# Altium schematic sheet ZHSD-ZYNQ-PL.SchDoc
size A3; DrawnBy: UGUR KELES; DocumentNumber: 14; SheetNumber: 14; SheetTotal: 17; Size: A3
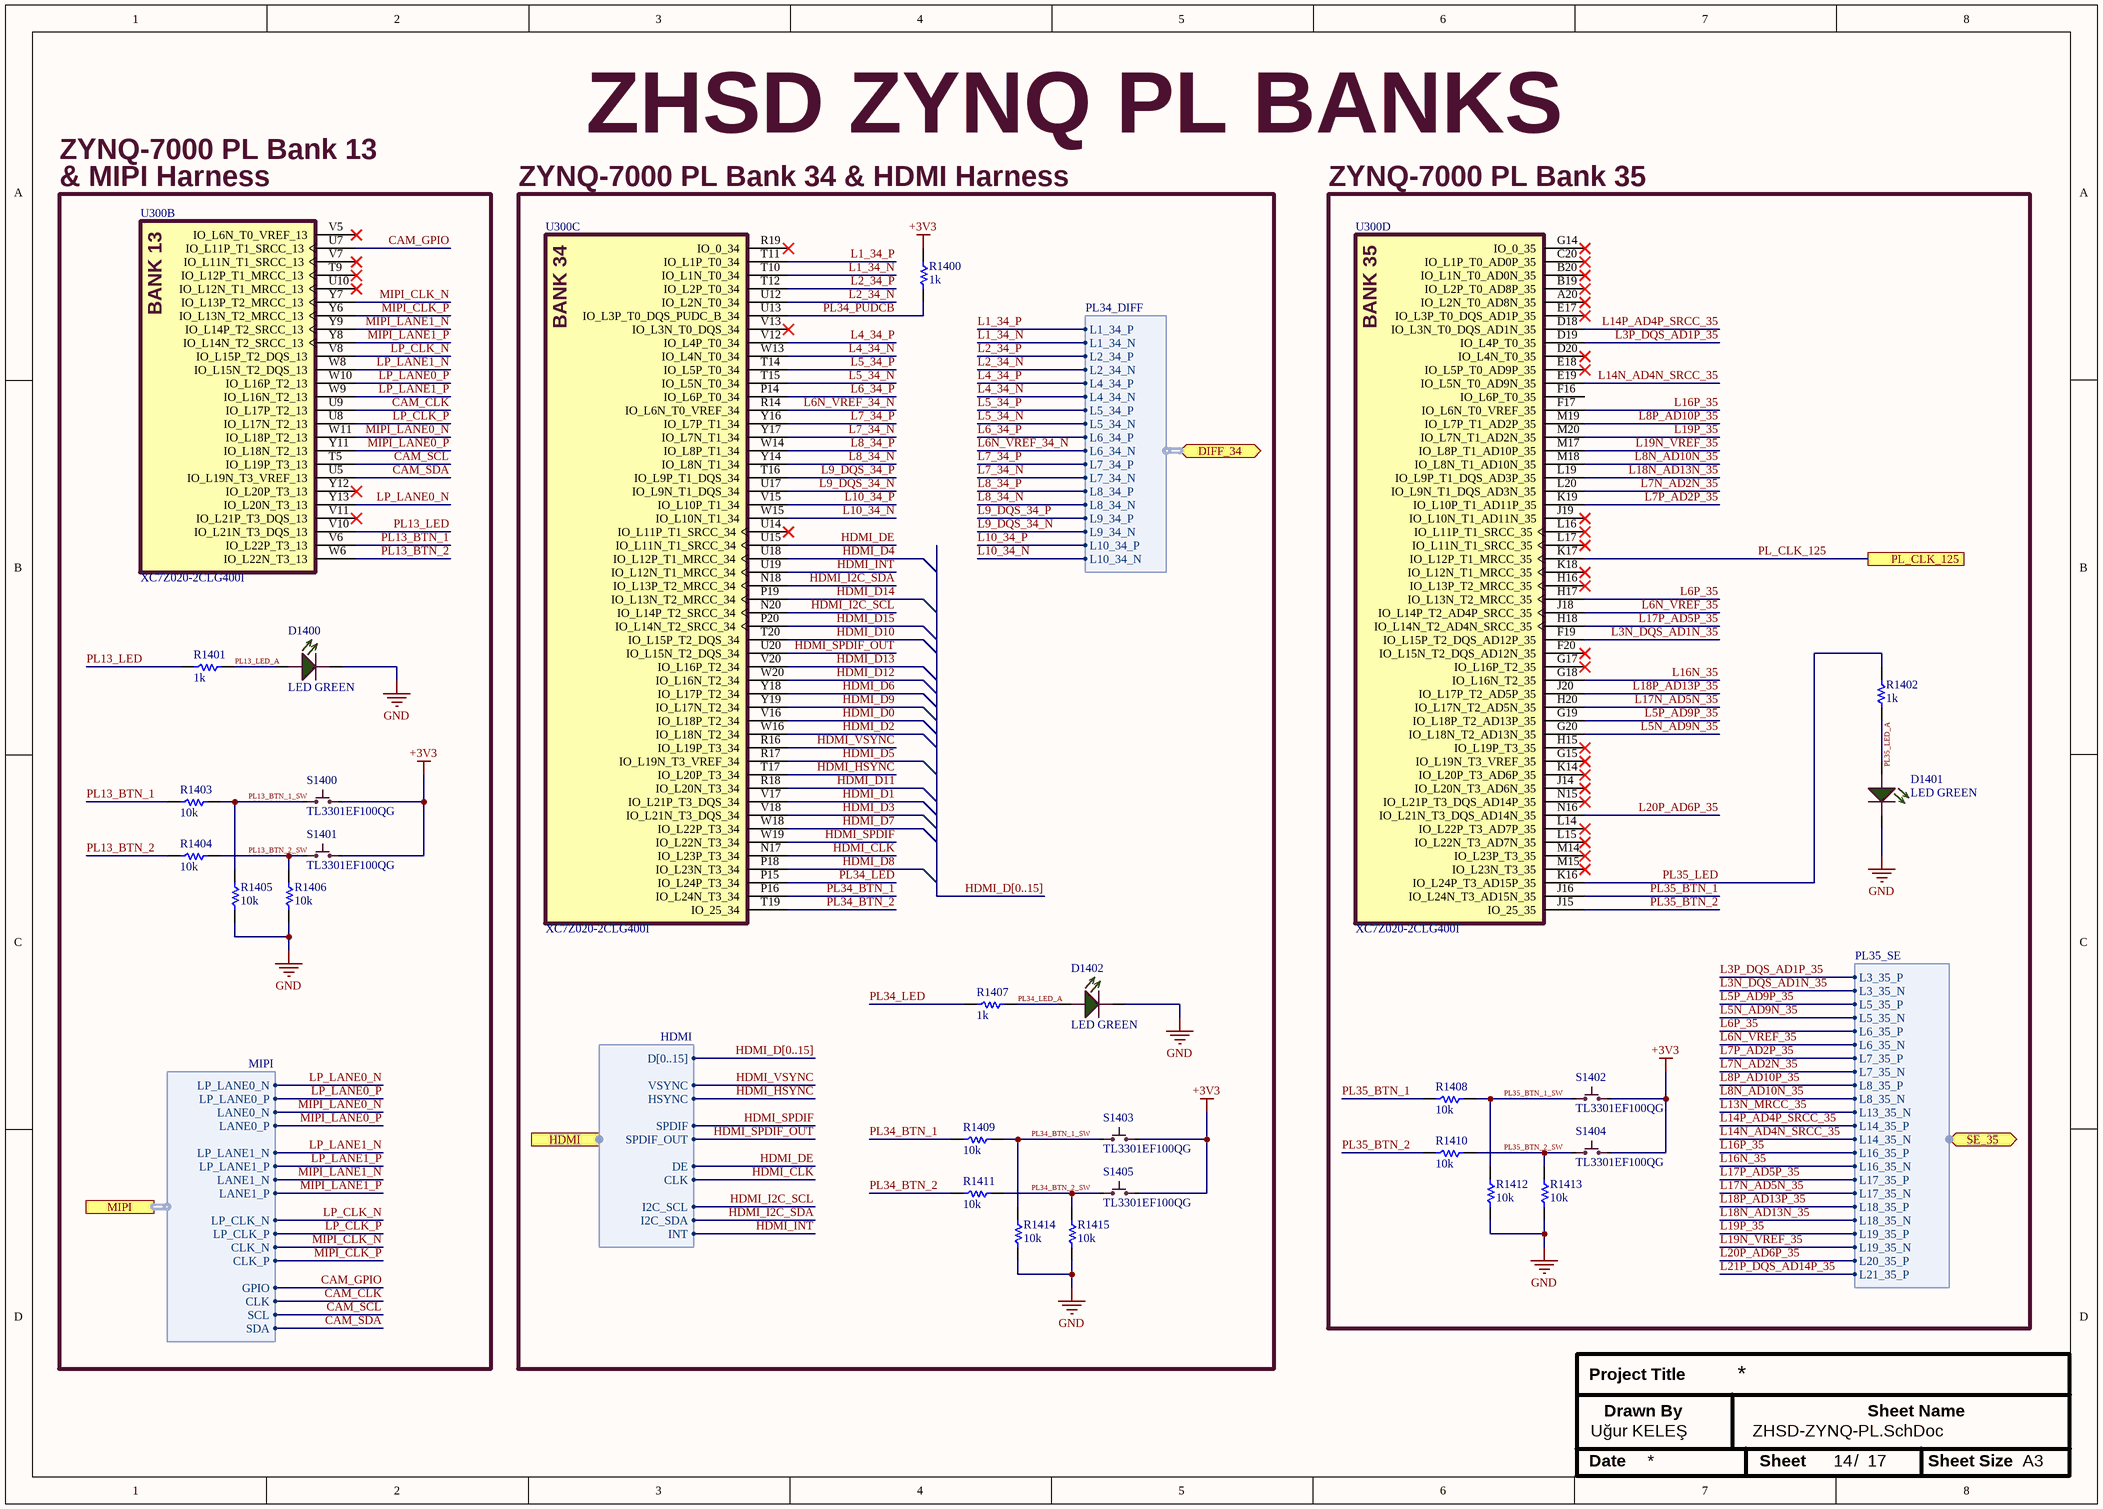
[diagram p0: ZHSD-ZYNQ-PL.SchDoc]

## Parts
D1400  LED GREEN  [0603_LED_1608N]
D1401  LED GREEN  [0603_LED_1608N]
D1402  LED GREEN  [0603_LED_1608N]
R1400  1k  [0402RESC1005X04N]
R1401  1k  [0402RESC1005X04N]
R1402  1k  [0402RESC1005X04N]
R1403  10k  [0603RESC1608X05N]
R1404  10k  [0603RESC1608X05N]
R1405  10k  [0603RESC1608X05N]
R1406  10k  [0603RESC1608X05N]
R1407  1k  [0402RESC1005X04N]
R1408  10k  [0603RESC1608X05N]
R1409  10k  [0603RESC1608X05N]
R1410  10k  [0603RESC1608X05N]
R1411  10k  [0603RESC1608X05N]
R1412  10k  [0603RESC1608X05N]
R1413  10k  [0603RESC1608X05N]
R1414  10k  [0603RESC1608X05N]
R1415  10k  [0603RESC1608X05N]
S1400  TL3301EF100QG  [TL3301_Tact_SW]
S1401  TL3301EF100QG  [TL3301_Tact_SW]
S1402  TL3301EF100QG  [TL3301_Tact_SW]
S1403  TL3301EF100QG  [TL3301_Tact_SW]
S1404  TL3301EF100QG  [TL3301_Tact_SW]
S1405  TL3301EF100QG  [TL3301_Tact_SW]
U300  XC7Z020-2CLG400I  [BGA400C80P20X20_1700X1700X147]  (parts B,C,D of 8)

## Blocks framed on the sheet
& MIPI Harness: D1400 R1401 R1403-R1406 S1400 S1401 U300
ZYNQ-7000 PL Bank 34 & HDMI Harness: D1402 R1400 R1407 R1409 R1411 R1414 R1415 S1403 S1405 U300
ZYNQ-7000 PL Bank 35: D1401 R1402 R1408 R1410 R1412 R1413 S1402 S1404 U300

## Ports
DIFF_34 (bidir, harness PL34_DIFF, see ZHSD-Block[7500,1700], ZHSD-PL-CONNS[500,4200]), HDMI (harness HDMI, see ZHSD-Block[4400,1600], ZHSD-HDMI[600,3600]), MIPI (harness MIPI, see ZHSD-Block[4400,900], ZHSD-MIPI-CSI2[1300,3900]), PL_CLK_125 (see ZHSD-Block[4400,1900], ZHSD-ETHERNET[3900,3000]), SE_35 (bidir, harness PL35_SE, see ZHSD-Block[7500,1400], ZHSD-PL-CONNS[10400,3800])

## Harnesses
HDMI: SPDIF, SPDIF_OUT, VSYNC, HSYNC, DE, CLK, INT, I2C_SCL, I2C_SDA, D[0..15]
MIPI: LANE0_N, LANE0_P, LANE1_N, LANE1_P, CLK_N, CLK_P, GPIO, CLK, SCL, SDA, LP_LANE0_N, LP_LANE0_P, LP_LANE1_N, LP_LANE1_P, LP_CLK_N, LP_CLK_P
PL34_DIFF: L1_34_P, L1_34_N, L2_34_P, L2_34_N, L4_34_P, L4_34_N, L5_34_P, L5_34_N, L6_34_P, L6_34_N, L7_34_P, L7_34_N, L8_34_P, L8_34_N, L9_34_P, L9_34_N, L10_34_P, L10_34_N
PL35_SE: L3_35_P, L3_35_N, L5_35_P, L5_35_N, L6_35_P, L6_35_N, L7_35_P, L7_35_N, L8_35_P, L8_35_N, L13_35_N, L14_35_P, L14_35_N, L16_35_P, L16_35_N, L17_35_P, L17_35_N, L18_35_P, L18_35_N, L19_35_P, L19_35_N, L20_35_P, L21_35_P

## Nets
+3V3: R1400.1 S1400.3,4 S1401.3,4 S1402.3,4 S1403.3,4 S1404.3,4 S1405.3,4
GND: D1400.2(C) D1401.2(C) D1402.2(C) R1405.2 R1406.2 R1412.2 R1413.2 R1414.2 R1415.2
CAM_CLK: U300.U9(IO_L17P_T2_13) ; port MIPI.CLK
CAM_GPIO: U300.U7(IO_L11P_T1_SRCC_13) ; port MIPI.GPIO
CAM_SCL: U300.T5(IO_L19P_T3_13) ; port MIPI.SCL
CAM_SDA: U300.U5(IO_L19N_T3_VREF_13) ; port MIPI.SDA
HDMI_CLK: U300.N17(IO_L23P_T3_34) ; port HDMI.CLK
HDMI_D0: U300.V16(IO_L18P_T2_34)
HDMI_D1: U300.V17(IO_L21P_T3_DQS_34)
HDMI_D2: U300.W16(IO_L18N_T2_34)
HDMI_D3: U300.V18(IO_L21N_T3_DQS_34)
HDMI_D4: U300.U18(IO_L12P_T1_MRCC_34)
HDMI_D5: U300.R17(IO_L19N_T3_VREF_34)
HDMI_D6: U300.Y18(IO_L17P_T2_34)
HDMI_D7: U300.W18(IO_L22P_T3_34)
HDMI_D8: U300.P18(IO_L23N_T3_34)
HDMI_D9: U300.Y19(IO_L17N_T2_34)
HDMI_D10: U300.T20(IO_L15P_T2_DQS_34)
HDMI_D11: U300.R18(IO_L20N_T3_34)
HDMI_D12: U300.W20(IO_L16N_T2_34)
HDMI_D13: U300.V20(IO_L16P_T2_34)
HDMI_D14: U300.P19(IO_L13N_T2_MRCC_34)
HDMI_D15: U300.P20(IO_L14N_T2_SRCC_34)
HDMI_DE: U300.U15(IO_L11N_T1_SRCC_34) ; port HDMI.DE
HDMI_HSYNC: U300.T17(IO_L20P_T3_34) ; port HDMI.HSYNC
HDMI_I2C_SCL: U300.N20(IO_L14P_T2_SRCC_34) ; port HDMI.I2C_SCL
HDMI_I2C_SDA: U300.N18(IO_L13P_T2_MRCC_34) ; port HDMI.I2C_SDA
HDMI_INT: U300.U19(IO_L12N_T1_MRCC_34) ; port HDMI.INT
HDMI_SPDIF: U300.W19(IO_L22N_T3_34) ; port HDMI.SPDIF
HDMI_SPDIF_OUT: U300.U20(IO_L15N_T2_DQS_34) ; port HDMI.SPDIF_OUT
HDMI_VSYNC: U300.R16(IO_L19P_T3_34) ; port HDMI.VSYNC
L1_34_N: U300.T10(IO_L1N_T0_34) ; port DIFF_34.L1_34_N
L1_34_P: U300.T11(IO_L1P_T0_34) ; port DIFF_34.L1_34_P
L2_34_N: U300.U12(IO_L2N_T0_34) ; port DIFF_34.L2_34_N
L2_34_P: U300.T12(IO_L2P_T0_34) ; port DIFF_34.L2_34_P
L3N_DQS_AD1N_35: U300.F19(IO_L15P_T2_DQS_AD12P_35) ; port SE_35.L3_35_N
L3P_DQS_AD1P_35: U300.D19(IO_L4P_T0_35) ; port SE_35.L3_35_P
L4_34_N: U300.W13(IO_L4N_T0_34) ; port DIFF_34.L4_34_N
L4_34_P: U300.V12(IO_L4P_T0_34) ; port DIFF_34.L4_34_P
L5_34_N: U300.T15(IO_L5N_T0_34) ; port DIFF_34.L5_34_N
L5_34_P: U300.T14(IO_L5P_T0_34) ; port DIFF_34.L5_34_P
L5N_AD9N_35: U300.G20(IO_L18N_T2_AD13N_35) ; port SE_35.L5_35_N
L5P_AD9P_35: U300.G19(IO_L18P_T2_AD13P_35) ; port SE_35.L5_35_P
L6_34_P: U300.P14(IO_L6P_T0_34) ; port DIFF_34.L6_34_P
L6N_VREF_34_N: U300.R14(IO_L6N_T0_VREF_34) ; port DIFF_34.L6_34_N
L6N_VREF_35: U300.J18(IO_L14P_T2_AD4P_SRCC_35) ; port SE_35.L6_35_N
L6P_35: U300.H17(IO_L13N_T2_MRCC_35) ; port SE_35.L6_35_P
L7_34_N: U300.Y17(IO_L7N_T1_34) ; port DIFF_34.L7_34_N
L7_34_P: U300.Y16(IO_L7P_T1_34) ; port DIFF_34.L7_34_P
L7N_AD2N_35: U300.L20(IO_L9N_T1_DQS_AD3N_35) ; port SE_35.L7_35_N
L7P_AD2P_35: U300.K19(IO_L10P_T1_AD11P_35) ; port SE_35.L7_35_P
L8_34_N: U300.Y14(IO_L8N_T1_34) ; port DIFF_34.L8_34_N
L8_34_P: U300.W14(IO_L8P_T1_34) ; port DIFF_34.L8_34_P
L8N_AD10N_35: U300.M18(IO_L8N_T1_AD10N_35) ; port SE_35.L8_35_N
L8P_AD10P_35: U300.M19(IO_L7P_T1_AD2P_35) ; port SE_35.L8_35_P
L9_DQS_34_N: U300.U17(IO_L9N_T1_DQS_34) ; port DIFF_34.L9_34_N
L9_DQS_34_P: U300.T16(IO_L9P_T1_DQS_34) ; port DIFF_34.L9_34_P
L10_34_N: U300.W15(IO_L10N_T1_34) ; port DIFF_34.L10_34_N
L10_34_P: U300.V15(IO_L10P_T1_34) ; port DIFF_34.L10_34_P
L13N_MRCC_35: port SE_35.L13_35_N
L14N_AD4N_SRCC_35: U300.E19(IO_L5N_T0_AD9N_35) ; port SE_35.L14_35_N
L14P_AD4P_SRCC_35: U300.D18(IO_L3N_T0_DQS_AD1N_35) ; port SE_35.L14_35_P
L16N_35: U300.G18(IO_L16N_T2_35) ; port SE_35.L16_35_N
L16P_35: U300.F17(IO_L6N_T0_VREF_35) ; port SE_35.L16_35_P
L17N_AD5N_35: U300.H20(IO_L17N_T2_AD5N_35) ; port SE_35.L17_35_N
L17P_AD5P_35: U300.H18(IO_L14N_T2_AD4N_SRCC_35) ; port SE_35.L17_35_P
L18N_AD13N_35: U300.L19(IO_L9P_T1_DQS_AD3P_35) ; port SE_35.L18_35_N
L18P_AD13P_35: U300.J20(IO_L17P_T2_AD5P_35) ; port SE_35.L18_35_P
L19N_VREF_35: U300.M17(IO_L8P_T1_AD10P_35) ; port SE_35.L19_35_N
L19P_35: U300.M20(IO_L7N_T1_AD2N_35) ; port SE_35.L19_35_P
L20P_AD6P_35: U300.N16(IO_L21N_T3_DQS_AD14N_35) ; port SE_35.L20_35_P
L21P_DQS_AD14P_35: port SE_35.L21_35_P
LP_CLK_N: U300.V8(IO_L15P_T2_DQS_13) ; port MIPI.LP_CLK_N
LP_CLK_P: U300.U8(IO_L17N_T2_13) ; port MIPI.LP_CLK_P
LP_LANE0_N: U300.Y13(IO_L20N_T3_13) ; port MIPI.LP_LANE0_N
LP_LANE0_P: U300.W10(IO_L16P_T2_13) ; port MIPI.LP_LANE0_P
LP_LANE1_N: U300.W8(IO_L15N_T2_DQS_13) ; port MIPI.LP_LANE1_N
LP_LANE1_P: U300.W9(IO_L16N_T2_13) ; port MIPI.LP_LANE1_P
MIPI_CLK_N: U300.Y7(IO_L13P_T2_MRCC_13) ; port MIPI.CLK_N
MIPI_CLK_P: U300.Y6(IO_L13N_T2_MRCC_13) ; port MIPI.CLK_P
MIPI_LANE0_N: U300.W11(IO_L18P_T2_13) ; port MIPI.LANE0_N
MIPI_LANE0_P: U300.Y11(IO_L18N_T2_13) ; port MIPI.LANE0_P
MIPI_LANE1_N: U300.Y9(IO_L14P_T2_SRCC_13) ; port MIPI.LANE1_N
MIPI_LANE1_P: U300.Y8(IO_L14N_T2_SRCC_13) ; port MIPI.LANE1_P
PL13_BTN_1: R1403.2 U300.V6(IO_L22P_T3_13)
PL13_BTN_1_SW: R1403.1 R1405.1 S1400.1,2
PL13_BTN_2: R1404.2 U300.W6(IO_L22N_T3_13)
PL13_BTN_2_SW: R1404.1 R1406.1 S1401.1,2
PL13_LED: R1401.2 U300.V10(IO_L21N_T3_DQS_13)
PL13_LED_A: D1400.1(A) R1401.1
PL34_BTN_1: R1409.2 U300.P16(IO_L24N_T3_34)
PL34_BTN_1_SW: R1409.1 R1414.1 S1403.1,2
PL34_BTN_2: R1411.2 U300.T19(IO_25_34)
PL34_BTN_2_SW: R1411.1 R1415.1 S1405.1,2
PL34_LED: R1407.2 U300.P15(IO_L24P_T3_34)
PL34_LED_A: D1402.1(A) R1407.1
PL34_PUDCB: R1400.2 U300.U13(IO_L3P_T0_DQS_PUDC_B_34)
PL35_BTN_1: R1408.2 U300.J16(IO_L24N_T3_AD15N_35)
PL35_BTN_1_SW: R1408.1 R1412.1 S1402.1,2
PL35_BTN_2: R1410.2 U300.J15(IO_25_35)
PL35_BTN_2_SW: R1410.1 R1413.1 S1404.1,2
PL35_LED: R1402.2 U300.K16(IO_L24P_T3_AD15P_35)
PL35_LED_A: D1401.1(A) R1402.1
PL_CLK_125: U300.K17(IO_L12P_T1_MRCC_35) ; port PL_CLK_125

Not connected (* = marked no-connect by the designer): U300 A20(IO_L2N_T0_AD8N_35)* B19(IO_L2P_T0_AD8P_35)* B20(IO_L1N_T0_AD0N_35)* C20(IO_L1P_T0_AD0P_35)* D20(IO_L4N_T0_35)* E17(IO_L3P_T0_DQS_AD1P_35)* E18(IO_L5P_T0_AD9P_35)* F16(IO_L6P_T0_35) F20(IO_L15N_T2_DQS_AD12N_35)* G14(IO_0_35)* G15(IO_L19N_T3_VREF_35)* G17(IO_L16P_T2_35)* H15(IO_L19P_T3_35)* H16(IO_L13P_T2_MRCC_35)* J14(IO_L20N_T3_AD6N_35)* J19(IO_L10N_T1_AD11N_35)* K14(IO_L20P_T3_AD6P_35)* K18(IO_L12N_T1_MRCC_35)* L14(IO_L22P_T3_AD7P_35)* L15(IO_L22N_T3_AD7N_35)* L16(IO_L11P_T1_SRCC_35)* L17(IO_L11N_T1_SRCC_35)* M14(IO_L23P_T3_35)* M15(IO_L23N_T3_35)* N15(IO_L21P_T3_DQS_AD14P_35)* R19(IO_0_34)* T9(IO_L12P_T1_MRCC_13)* U10(IO_L12N_T1_MRCC_13)* U14(IO_L11P_T1_SRCC_34)* V5(IO_L6N_T0_VREF_13)* V7(IO_L11N_T1_SRCC_13)* V11(IO_L21P_T3_DQS_13)* V13(IO_L3N_T0_DQS_34)* Y12(IO_L20P_T3_13)*

## Buses and harness runs
bus HDMI_D[0..15]

## Notes on the sheet
- ZYNQ-7000 PL Bank 13
- ZHSD ZYNQ PL BANKS
- Project Title
- Uğur KELEŞ
- Drawn By
- Sheet Name
- Date
- Sheet
- /
- Sheet Size
- A3
- (in symbol XC7Z020-2CLG400I, part B) BANK 13
- (in symbol XC7Z020-2CLG400I, part C) BANK 34
- (in symbol XC7Z020-2CLG400I, part D) BANK 35

## Library data of the parts
D1400-D1402 = LTST-C191TGKT: LED GREEN CLEAR CHIP SMD; Manufacturer: Lite-On Inc.; ComponentLink1Description: Datasheet; ComponentLink1URL: https://optoelectronics.liteon.com/upload/download/DS22-2000-300/LTST-C191TGKT.PDF; MPN: LTST-C191TGKT; Package: 0603
R1400-R1402 R1407 = RC0402JR-071KL: RES 1K OHM 5% 1/16W 0402 (1005); Manufacturer: YAGEO; Value: 1 kOhms; Voltage: 50V; ComponentLink1Description: Datasheet; ComponentLink1URL: https://yageogroup.com/content/datasheet/asset/file/PYU-RT_1-TO-0-01_ROHS_L; MPN: RC0402JR-071KL; Tolerance: ±5%; Package: 0402
R1403-R1406 R1408-R1415 = RC0603FR-0710KL: RES 10K OHM 1% 1/10W 0603(1608); Manufacturer: YAGEO; Value: 10 kOhms; Voltage: 75V; ComponentLink1Description: Datasheet; ComponentLink1URL: https://yageogroup.com/content/datasheet/asset/file/PYU-RC_GROUP_51_ROHS_L; MPN: RC0603FR-0710KL; Tolerance: ±1%; Package: 0603
S1400-S1405 = TL3301EF100QG: SWITCH TACTILE SPST-NO 0.05A 12V; pin to pad: 1,2>1+2 3,4>3+4; Manufacturer: E-Switch; ComponentLink1Description: Datasheet; ComponentLink1URL: https://configured-product-images.s3.amazonaws.com/Datasheets/TL3301.pdf; MPN: TL3301EF100QG
U300 = XC7Z020-2CLG400I: Dual ARM® Cortex®-A9 MPCore™ with CoreSight™ System On Chip (SOC) IC Zynq®-7000 Artix™-7 FPGA, 85K Logic Cells 766MHz 400-CSPBGA (17x17); Manufacturer: AMD/XILINX; MPN: XC7Z020-2CLG400I; ComponentLink1Description: Datasheet; ComponentLink1URL: https://docs.amd.com/v/u/en-US/ds190-Zynq-7000-Overview; ComponentLink2Description: DC and AC Switching Characteristics; ComponentLink2URL: https://docs.amd.com/v/u/en-US/ds187-XC7Z010-XC7Z020-Data-Sheet; ComponentLink3Description: PCB Design Guide; ComponentLink3URL: https://docs.amd.com/v/u/en-US/ug933-Zynq-7000-PCB; ComponentLink4Description: Packaging and Pinout; ComponentLink4URL: https://docs.amd.com/v/u/en-US/ug865-Zynq-7000-Pkg-Pinout; ComponentLink5Description: Zynq 7000 SoC Technical Reference Manual; ComponentLink5URL: https://docs.amd.com/r/en-US/ug585-zynq-7000-SoC-TRM